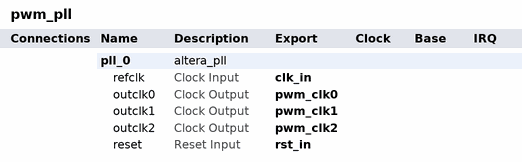
[diagram p0: system contents]
# Platform Designer (Qsys) system pwm_pll, Cyclone V 5CSEMA5F31C6
# Parameters at their usual value, and those the tool derives, are not listed.
package require -exact qsys 15.0
create_system pwm_pll
set_project_property DEVICE_FAMILY {Cyclone V}
set_project_property DEVICE 5CSEMA5F31C6

add_instance pll_0 altera_pll 15.0
set_instance_parameter_value pll_0 gui_device_speed_grade 1
set_instance_parameter_value pll_0 gui_number_of_clocks 3
set_instance_parameter_value pll_0 gui_operation_mode normal
set_instance_parameter_value pll_0 gui_output_clock_frequency0 5.0
set_instance_parameter_value pll_0 gui_output_clock_frequency1 5.0
set_instance_parameter_value pll_0 gui_output_clock_frequency2 5.0
set_instance_parameter_value pll_0 gui_pll_mode {Integer-N PLL}
set_instance_parameter_value pll_0 gui_reference_clock_frequency 50.0
set_instance_parameter_value pll_0 gui_use_locked false

# exported interfaces
add_interface clk_in clock sink
set_interface_property clk_in EXPORT_OF pll_0.refclk
add_interface pwm_clk0 clock source
set_interface_property pwm_clk0 EXPORT_OF pll_0.outclk0
add_interface pwm_clk1 clock source
set_interface_property pwm_clk1 EXPORT_OF pll_0.outclk1
add_interface pwm_clk2 clock source
set_interface_property pwm_clk2 EXPORT_OF pll_0.outclk2
add_interface rst_in reset sink
set_interface_property rst_in EXPORT_OF pll_0.reset

set_interconnect_requirement {$system} qsys_mm.clockCrossingAdapter HANDSHAKE
set_interconnect_requirement {$system} qsys_mm.enableEccProtection FALSE
set_interconnect_requirement {$system} qsys_mm.insertDefaultSlave FALSE
set_interconnect_requirement {$system} qsys_mm.maxAdditionalLatency 1

save_system pwm_pll.qsys
